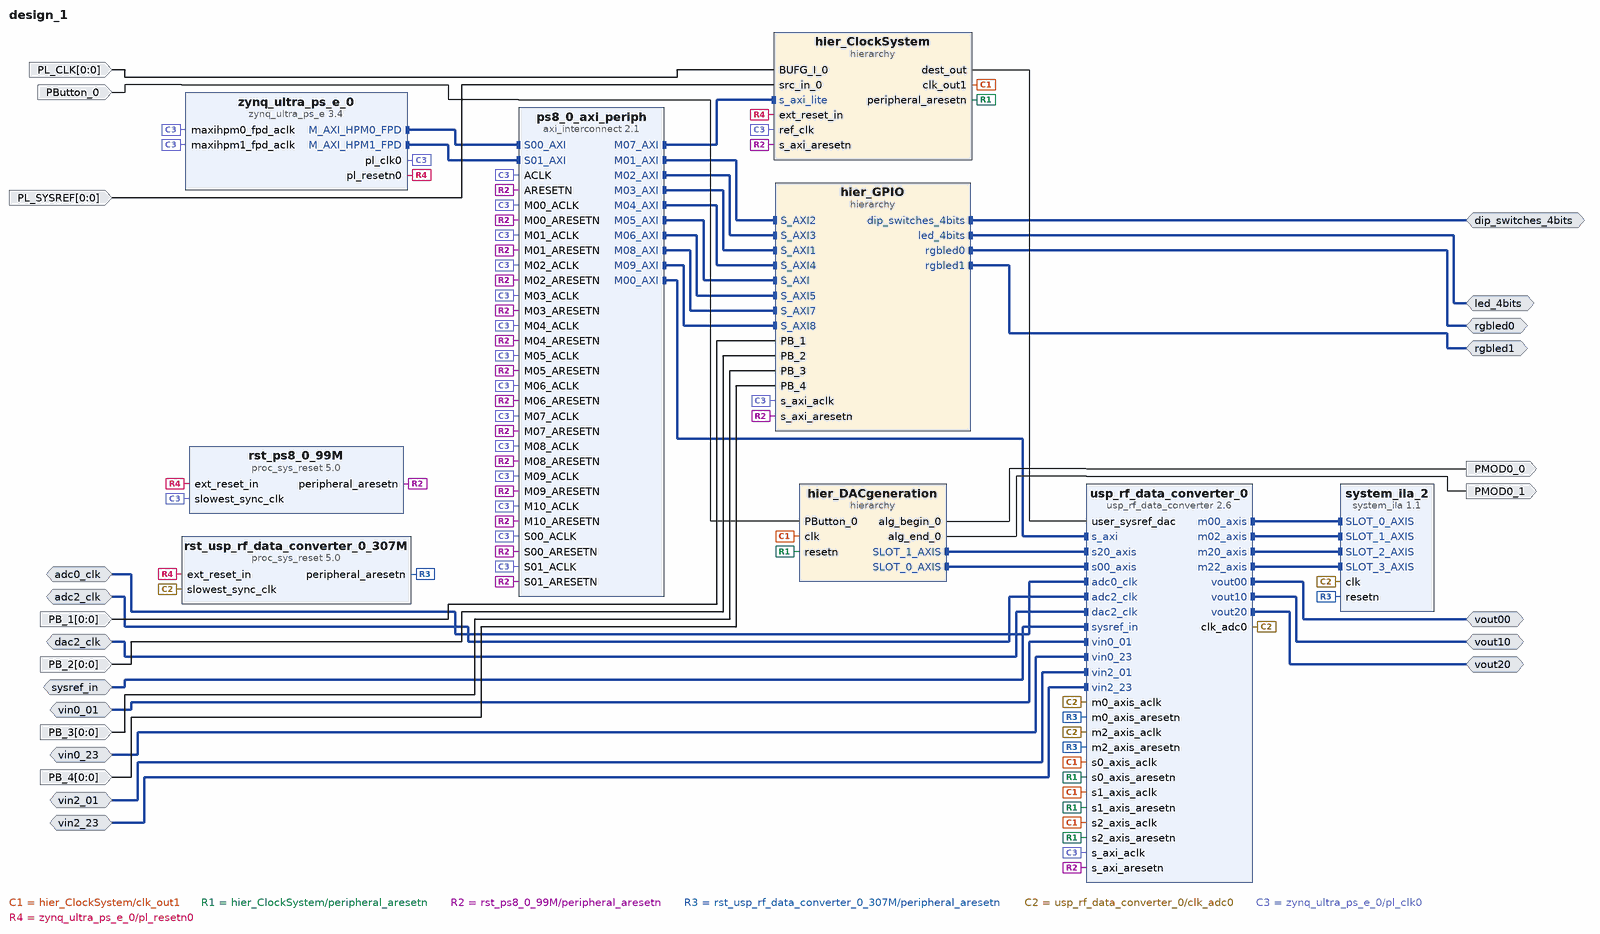
[diagram p0: block diagram of the top level]
# Vivado block design design_1, xczu48dr-ffvg1517-2-e, Vivado 2022.1
create_bd_design design_1

create_bd_intf_port -mode Slave -vlnv xilinx.com:display_usp_rf_data_converter:diff_pins_rtl:1.0 sysref_in
create_bd_intf_port -mode Slave -vlnv xilinx.com:interface:diff_clock_rtl:1.0 adc0_clk
set_property -dict {CONFIG.FREQ_HZ 2000000000.0} [get_bd_intf_ports adc0_clk]
create_bd_intf_port -mode Slave -vlnv xilinx.com:interface:diff_analog_io_rtl:1.0 vin0_01
create_bd_intf_port -mode Master -vlnv xilinx.com:interface:diff_analog_io_rtl:1.0 vout00
create_bd_intf_port -mode Master -vlnv xilinx.com:interface:gpio_rtl:1.0 dip_switches_4bits
create_bd_intf_port -mode Master -vlnv xilinx.com:interface:gpio_rtl:1.0 led_4bits
create_bd_intf_port -mode Master -vlnv xilinx.com:interface:gpio_rtl:1.0 rgbled0
create_bd_intf_port -mode Master -vlnv xilinx.com:interface:gpio_rtl:1.0 rgbled1
create_bd_intf_port -mode Slave -vlnv xilinx.com:interface:diff_analog_io_rtl:1.0 vin0_23
create_bd_intf_port -mode Slave -vlnv xilinx.com:interface:diff_clock_rtl:1.0 adc2_clk
set_property -dict {CONFIG.FREQ_HZ 491520000.0} [get_bd_intf_ports adc2_clk]
create_bd_intf_port -mode Slave -vlnv xilinx.com:interface:diff_analog_io_rtl:1.0 vin2_01
create_bd_intf_port -mode Slave -vlnv xilinx.com:interface:diff_analog_io_rtl:1.0 vin2_23
create_bd_intf_port -mode Slave -vlnv xilinx.com:interface:diff_clock_rtl:1.0 dac2_clk
set_property -dict {CONFIG.FREQ_HZ 491520000.0} [get_bd_intf_ports dac2_clk]
create_bd_intf_port -mode Master -vlnv xilinx.com:interface:diff_analog_io_rtl:1.0 vout20
create_bd_intf_port -mode Master -vlnv xilinx.com:interface:diff_analog_io_rtl:1.0 vout10
create_bd_port -dir I PButton_0
create_bd_port -dir I -from 0 -to 0 PB_1
create_bd_port -dir I -from 0 -to 0 PB_2
create_bd_port -dir I -from 0 -to 0 PB_3
create_bd_port -dir I -from 0 -to 0 PB_4
create_bd_port -dir I -from 0 -to 0 -type clk PL_CLK
set_property -dict {CONFIG.FREQ_HZ 500000000} [get_bd_ports PL_CLK]
create_bd_port -dir I -from 0 -to 0 PL_SYSREF
create_bd_port -dir O PMOD0_0
create_bd_port -dir O PMOD0_1

create_bd_cell -type ip -vlnv xilinx.com:ip:zynq_ultra_ps_e:3.4 zynq_ultra_ps_e_0
set_property -dict [list \
  CONFIG.PSU_BANK_0_IO_STANDARD LVCMOS33 \
  CONFIG.PSU_BANK_1_IO_STANDARD LVCMOS18 \
  CONFIG.PSU_BANK_2_IO_STANDARD LVCMOS18 \
  CONFIG.PSU_BANK_3_IO_STANDARD LVCMOS18 \
  CONFIG.PSU_USB3__DUAL_CLOCK_ENABLE 1 \
  CONFIG.PSU__CAN1__PERIPHERAL__ENABLE 0 \
  CONFIG.PSU__CRF_APB__ACPU_CTRL__FREQMHZ 1200 \
  CONFIG.PSU__CRF_APB__ACPU_CTRL__SRCSEL APLL \
  CONFIG.PSU__CRF_APB__APLL_CTRL__SRCSEL PSS_REF_CLK \
  CONFIG.PSU__CRF_APB__DBG_FPD_CTRL__FREQMHZ 250 \
  CONFIG.PSU__CRF_APB__DBG_FPD_CTRL__SRCSEL IOPLL \
  CONFIG.PSU__CRF_APB__DBG_TRACE_CTRL__FREQMHZ 250 \
  CONFIG.PSU__CRF_APB__DBG_TSTMP_CTRL__FREQMHZ 250 \
  CONFIG.PSU__CRF_APB__DBG_TSTMP_CTRL__SRCSEL IOPLL \
  CONFIG.PSU__CRF_APB__DDR_CTRL__FREQMHZ 1200 \
  CONFIG.PSU__CRF_APB__DDR_CTRL__SRCSEL DPLL \
  CONFIG.PSU__CRF_APB__DPDMA_REF_CTRL__FREQMHZ 600 \
  CONFIG.PSU__CRF_APB__DPDMA_REF_CTRL__SRCSEL DPLL \
  CONFIG.PSU__CRF_APB__DPLL_CTRL__SRCSEL PSS_REF_CLK \
  CONFIG.PSU__CRF_APB__DP_AUDIO_REF_CTRL__SRCSEL RPLL \
  CONFIG.PSU__CRF_APB__DP_STC_REF_CTRL__SRCSEL RPLL \
  CONFIG.PSU__CRF_APB__GDMA_REF_CTRL__FREQMHZ 600 \
  CONFIG.PSU__CRF_APB__GDMA_REF_CTRL__SRCSEL DPLL \
  CONFIG.PSU__CRF_APB__GPU_REF_CTRL__FREQMHZ 600 \
  CONFIG.PSU__CRF_APB__TOPSW_LSBUS_CTRL__FREQMHZ 100 \
  CONFIG.PSU__CRF_APB__TOPSW_LSBUS_CTRL__SRCSEL IOPLL \
  CONFIG.PSU__CRF_APB__TOPSW_MAIN_CTRL__FREQMHZ 533.33 \
  CONFIG.PSU__CRF_APB__TOPSW_MAIN_CTRL__SRCSEL DPLL \
  CONFIG.PSU__CRF_APB__VPLL_CTRL__SRCSEL PSS_REF_CLK \
  CONFIG.PSU__CRL_APB__ADMA_REF_CTRL__FREQMHZ 533.333 \
  CONFIG.PSU__CRL_APB__ADMA_REF_CTRL__SRCSEL RPLL \
  CONFIG.PSU__CRL_APB__CAN1_REF_CTRL__SRCSEL IOPLL \
  CONFIG.PSU__CRL_APB__CPU_R5_CTRL__FREQMHZ 500 \
  CONFIG.PSU__CRL_APB__CPU_R5_CTRL__SRCSEL IOPLL \
  CONFIG.PSU__CRL_APB__DBG_LPD_CTRL__FREQMHZ 250 \
  CONFIG.PSU__CRL_APB__DBG_LPD_CTRL__SRCSEL IOPLL \
  CONFIG.PSU__CRL_APB__GEM3_REF_CTRL__FREQMHZ 125 \
  CONFIG.PSU__CRL_APB__GEM3_REF_CTRL__SRCSEL IOPLL \
  CONFIG.PSU__CRL_APB__I2C1_REF_CTRL__FREQMHZ 100 \
  CONFIG.PSU__CRL_APB__I2C1_REF_CTRL__SRCSEL IOPLL \
  CONFIG.PSU__CRL_APB__IOPLL_CTRL__SRCSEL PSS_REF_CLK \
  CONFIG.PSU__CRL_APB__IOU_SWITCH_CTRL__FREQMHZ 267 \
  CONFIG.PSU__CRL_APB__IOU_SWITCH_CTRL__SRCSEL RPLL \
  CONFIG.PSU__CRL_APB__LPD_LSBUS_CTRL__FREQMHZ 100 \
  CONFIG.PSU__CRL_APB__LPD_LSBUS_CTRL__SRCSEL IOPLL \
  CONFIG.PSU__CRL_APB__LPD_SWITCH_CTRL__FREQMHZ 533.333 \
  CONFIG.PSU__CRL_APB__LPD_SWITCH_CTRL__SRCSEL RPLL \
  CONFIG.PSU__CRL_APB__PCAP_CTRL__FREQMHZ 200 \
  CONFIG.PSU__CRL_APB__PCAP_CTRL__SRCSEL IOPLL \
  CONFIG.PSU__CRL_APB__PL0_REF_CTRL__FREQMHZ 100 \
  CONFIG.PSU__CRL_APB__PL0_REF_CTRL__SRCSEL IOPLL \
  CONFIG.PSU__CRL_APB__QSPI_REF_CTRL__FREQMHZ 125 \
  CONFIG.PSU__CRL_APB__RPLL_CTRL__SRCSEL PSS_REF_CLK \
  CONFIG.PSU__CRL_APB__SDIO0_REF_CTRL__SRCSEL IOPLL \
  CONFIG.PSU__CRL_APB__SDIO1_REF_CTRL__FREQMHZ 200 \
  CONFIG.PSU__CRL_APB__SDIO1_REF_CTRL__SRCSEL IOPLL \
  CONFIG.PSU__CRL_APB__SPI0_REF_CTRL__SRCSEL IOPLL \
  CONFIG.PSU__CRL_APB__SPI1_REF_CTRL__SRCSEL IOPLL \
  CONFIG.PSU__CRL_APB__TIMESTAMP_REF_CTRL__FREQMHZ 100 \
  CONFIG.PSU__CRL_APB__TIMESTAMP_REF_CTRL__SRCSEL PSS_REF_CLK \
  CONFIG.PSU__CRL_APB__UART0_REF_CTRL__FREQMHZ 100 \
  CONFIG.PSU__CRL_APB__UART0_REF_CTRL__SRCSEL IOPLL \
  CONFIG.PSU__CRL_APB__USB0_BUS_REF_CTRL__FREQMHZ 250 \
  CONFIG.PSU__CRL_APB__USB0_BUS_REF_CTRL__SRCSEL IOPLL \
  CONFIG.PSU__CRL_APB__USB3_DUAL_REF_CTRL__FREQMHZ 20 \
  CONFIG.PSU__CRL_APB__USB3_DUAL_REF_CTRL__SRCSEL IOPLL \
  CONFIG.PSU__CRL_APB__USB3__ENABLE 1 \
  CONFIG.PSU__DDRC__BUS_WIDTH {64 Bit} \
  CONFIG.PSU__DDRC__COMPONENTS Components \
  CONFIG.PSU__DDRC__DEVICE_CAPACITY {8192 MBits} \
  CONFIG.PSU__DDRC__DRAM_WIDTH {16 Bits} \
  CONFIG.PSU__DDRC__ECC Disabled \
  CONFIG.PSU__DDRC__MEMORY_TYPE {DDR 4} \
  CONFIG.PSU__DDRC__SPEED_BIN DDR4_2400R \
  CONFIG.PSU__DDR_HIGH_ADDRESS_GUI_ENABLE 1 \
  CONFIG.PSU__DDR__INTERFACE__FREQMHZ 600.000 \
  CONFIG.PSU__DISPLAYPORT__LANE0__ENABLE 1 \
  CONFIG.PSU__DISPLAYPORT__LANE0__IO {GT Lane1} \
  CONFIG.PSU__DISPLAYPORT__LANE1__ENABLE 1 \
  CONFIG.PSU__DISPLAYPORT__LANE1__IO {GT Lane0} \
  CONFIG.PSU__DISPLAYPORT__PERIPHERAL__ENABLE 1 \
  CONFIG.PSU__DLL__ISUSED 1 \
  CONFIG.PSU__DPAUX__PERIPHERAL__ENABLE 1 \
  CONFIG.PSU__DPAUX__PERIPHERAL__IO {MIO 27 .. 30} \
  CONFIG.PSU__DP__LANE_SEL {Dual Lower} \
  CONFIG.PSU__DP__REF_CLK_FREQ 27 \
  CONFIG.PSU__DP__REF_CLK_SEL {Ref Clk0} \
  CONFIG.PSU__ENET1__GRP_MDIO__ENABLE 1 \
  CONFIG.PSU__ENET1__GRP_MDIO__IO {MIO 50 .. 51} \
  CONFIG.PSU__ENET1__PERIPHERAL__ENABLE 1 \
  CONFIG.PSU__ENET1__PERIPHERAL__IO {MIO 38 .. 49} \
  CONFIG.PSU__FPGA_PL0_ENABLE 1 \
  CONFIG.PSU__GEM__TSU__ENABLE 0 \
  CONFIG.PSU__GPIO0_MIO__IO {MIO 0 .. 25} \
  CONFIG.PSU__GPIO0_MIO__PERIPHERAL__ENABLE 1 \
  CONFIG.PSU__GPIO1_MIO__IO {MIO 26 .. 51} \
  CONFIG.PSU__GPIO1_MIO__PERIPHERAL__ENABLE 1 \
  CONFIG.PSU__GPIO2_MIO__IO {MIO 52 .. 77} \
  CONFIG.PSU__GPIO2_MIO__PERIPHERAL__ENABLE 1 \
  CONFIG.PSU__GPIO_EMIO_WIDTH 41 \
  CONFIG.PSU__GPIO_EMIO__PERIPHERAL__ENABLE 1 \
  CONFIG.PSU__GPIO_EMIO__PERIPHERAL__IO 41 \
  CONFIG.PSU__GT__LINK_SPEED HBR \
  CONFIG.PSU__GT__PRE_EMPH_LVL_4 0 \
  CONFIG.PSU__GT__VLT_SWNG_LVL_4 0 \
  CONFIG.PSU__I2C0__PERIPHERAL__ENABLE 1 \
  CONFIG.PSU__I2C0__PERIPHERAL__IO {MIO 18 .. 19} \
  CONFIG.PSU__I2C1__PERIPHERAL__ENABLE 1 \
  CONFIG.PSU__I2C1__PERIPHERAL__IO {MIO 36 .. 37} \
  CONFIG.PSU__MAXIGP0__DATA_WIDTH 128 \
  CONFIG.PSU__OVERRIDE__BASIC_CLOCK 0 \
  CONFIG.PSU__PMU__PERIPHERAL__ENABLE 0 \
  CONFIG.PSU__PRESET_APPLIED 1 \
  CONFIG.PSU__PSS_REF_CLK__FREQMHZ 33.33333 \
  CONFIG.PSU__QSPI__PERIPHERAL__ENABLE 0 \
  CONFIG.PSU__SD0__CLK_50_SDR_ITAP_DLY 0x15 \
  CONFIG.PSU__SD0__CLK_50_SDR_OTAP_DLY 0x5 \
  CONFIG.PSU__SD0__DATA_TRANSFER_MODE 4Bit \
  CONFIG.PSU__SD0__GRP_CD__ENABLE 1 \
  CONFIG.PSU__SD0__GRP_CD__IO {MIO 24} \
  CONFIG.PSU__SD0__GRP_WP__ENABLE 1 \
  CONFIG.PSU__SD0__GRP_WP__IO {MIO 25} \
  CONFIG.PSU__SD0__PERIPHERAL__ENABLE 1 \
  CONFIG.PSU__SD0__PERIPHERAL__IO {MIO 13 .. 16 21 22} \
  CONFIG.PSU__SD0__SLOT_TYPE {SD 2.0} \
  CONFIG.PSU__SPI0__GRP_SS0__IO {MIO 3} \
  CONFIG.PSU__SPI0__GRP_SS1__ENABLE 1 \
  CONFIG.PSU__SPI0__GRP_SS1__IO {MIO 2} \
  CONFIG.PSU__SPI0__GRP_SS2__ENABLE 1 \
  CONFIG.PSU__SPI0__GRP_SS2__IO {MIO 1} \
  CONFIG.PSU__SPI0__PERIPHERAL__ENABLE 1 \
  CONFIG.PSU__SPI0__PERIPHERAL__IO {MIO 0 .. 5} \
  CONFIG.PSU__SPI1__GRP_SS0__IO {MIO 9} \
  CONFIG.PSU__SPI1__PERIPHERAL__ENABLE 1 \
  CONFIG.PSU__SPI1__PERIPHERAL__IO {MIO 6 .. 11} \
  CONFIG.PSU__TSU__BUFG_PORT_PAIR 0 \
  CONFIG.PSU__UART0__PERIPHERAL__ENABLE 0 \
  CONFIG.PSU__UART1__BAUD_RATE 115200 \
  CONFIG.PSU__UART1__MODEM__ENABLE 0 \
  CONFIG.PSU__UART1__PERIPHERAL__ENABLE 1 \
  CONFIG.PSU__UART1__PERIPHERAL__IO {MIO 32 .. 33} \
  CONFIG.PSU__USB0_COHERENCY 0 \
  CONFIG.PSU__USB0__PERIPHERAL__ENABLE 1 \
  CONFIG.PSU__USB0__PERIPHERAL__IO {MIO 52 .. 63} \
  CONFIG.PSU__USB0__REF_CLK_FREQ 100 \
  CONFIG.PSU__USB0__REF_CLK_SEL {Ref Clk1} \
  CONFIG.PSU__USB1__PERIPHERAL__ENABLE 1 \
  CONFIG.PSU__USB1__PERIPHERAL__IO {MIO 64 .. 75} \
  CONFIG.PSU__USB1__REF_CLK_FREQ 100 \
  CONFIG.PSU__USB1__REF_CLK_SEL {Ref Clk1} \
  CONFIG.PSU__USB2_0__EMIO__ENABLE 0 \
  CONFIG.PSU__USB3_0__EMIO__ENABLE 0 \
  CONFIG.PSU__USB3_0__PERIPHERAL__ENABLE 1 \
  CONFIG.PSU__USB3_0__PERIPHERAL__IO {GT Lane2} \
  CONFIG.PSU__USB3_1__PERIPHERAL__ENABLE 1 \
  CONFIG.PSU__USB3_1__PERIPHERAL__IO {GT Lane3} \
  CONFIG.PSU__USB__RESET__MODE {Boot Pin} \
  CONFIG.PSU__USB__RESET__POLARITY {Active Low} \
  CONFIG.PSU__USE__IRQ0 1 \
  CONFIG.PSU__USE__IRQ1 1 \
  CONFIG.PSU__USE__M_AXI_GP0 1 \
  CONFIG.PSU__USE__M_AXI_GP1 1 \
  CONFIG.PSU__USE__M_AXI_GP2 0 \
] [get_bd_cells zynq_ultra_ps_e_0]
# 106 more settings of zynq_ultra_ps_e_0 are not shown: defaults, MIO pin electricals, DDR timing, and values the tool derives
create_bd_cell -type ip -vlnv xilinx.com:ip:usp_rf_data_converter:2.6 usp_rf_data_converter_0
set_property -dict [list \
  CONFIG.ADC0_Link_Coupling 0 \
  CONFIG.ADC0_Outclk_Freq 281.250 \
  CONFIG.ADC0_PLL_Enable true \
  CONFIG.ADC0_Refclk_Freq 500.000 \
  CONFIG.ADC0_Sampling_Rate 4.5 \
  CONFIG.ADC2_Outclk_Freq 281.250 \
  CONFIG.ADC2_PLL_Enable true \
  CONFIG.ADC2_Refclk_Freq 500.000 \
  CONFIG.ADC2_Sampling_Rate 4.5 \
  CONFIG.ADC_Coarse_Mixer_Freq02 3 \
  CONFIG.ADC_Coarse_Mixer_Freq20 3 \
  CONFIG.ADC_Coarse_Mixer_Freq22 3 \
  CONFIG.ADC_Data_Width00 1 \
  CONFIG.ADC_Data_Width02 1 \
  CONFIG.ADC_Data_Width20 1 \
  CONFIG.ADC_Data_Width22 1 \
  CONFIG.ADC_Decimation_Mode00 16 \
  CONFIG.ADC_Decimation_Mode02 16 \
  CONFIG.ADC_Decimation_Mode20 16 \
  CONFIG.ADC_Decimation_Mode22 16 \
  CONFIG.ADC_Mixer_Type02 1 \
  CONFIG.ADC_Mixer_Type20 1 \
  CONFIG.ADC_Mixer_Type22 1 \
  CONFIG.ADC_OBS02 false \
  CONFIG.ADC_OBS22 false \
  CONFIG.ADC_Slice02_Enable true \
  CONFIG.ADC_Slice20_Enable true \
  CONFIG.ADC_Slice22_Enable true \
  CONFIG.DAC0_Clock_Source 6 \
  CONFIG.DAC0_Link_Coupling 0 \
  CONFIG.DAC0_Multi_Tile_Sync true \
  CONFIG.DAC0_Outclk_Freq 406.250 \
  CONFIG.DAC0_PLL_Enable false \
  CONFIG.DAC0_Refclk_Freq 6500.000 \
  CONFIG.DAC0_Sampling_Rate 6.5 \
  CONFIG.DAC1_Multi_Tile_Sync true \
  CONFIG.DAC1_Outclk_Freq 406.250 \
  CONFIG.DAC1_PLL_Enable false \
  CONFIG.DAC1_Refclk_Freq 6500.000 \
  CONFIG.DAC1_Sampling_Rate 6.5 \
  CONFIG.DAC2_Clock_Dist 2 \
  CONFIG.DAC2_Multi_Tile_Sync true \
  CONFIG.DAC2_Outclk_Freq 406.250 \
  CONFIG.DAC2_PLL_Enable true \
  CONFIG.DAC2_Refclk_Freq 500.000 \
  CONFIG.DAC2_Sampling_Rate 6.5 \
  CONFIG.DAC_Coarse_Mixer_Freq00 3 \
  CONFIG.DAC_Coarse_Mixer_Freq10 3 \
  CONFIG.DAC_Coarse_Mixer_Freq20 3 \
  CONFIG.DAC_Data_Width00 16 \
  CONFIG.DAC_Data_Width10 16 \
  CONFIG.DAC_Data_Width20 16 \
  CONFIG.DAC_Interpolation_Mode00 1 \
  CONFIG.DAC_Interpolation_Mode10 1 \
  CONFIG.DAC_Interpolation_Mode20 1 \
  CONFIG.DAC_Mixer_Type00 1 \
  CONFIG.DAC_Mixer_Type10 1 \
  CONFIG.DAC_Mixer_Type20 1 \
  CONFIG.DAC_Slice00_Enable true \
  CONFIG.DAC_Slice10_Enable true \
  CONFIG.DAC_Slice20_Enable true \
] [get_bd_cells usp_rf_data_converter_0]
create_bd_cell -type ip -vlnv xilinx.com:ip:axi_interconnect:2.1 ps8_0_axi_periph
set_property -dict {CONFIG.NUM_MI 11 CONFIG.NUM_SI 2} [get_bd_cells ps8_0_axi_periph]
create_bd_cell -type ip -vlnv xilinx.com:ip:proc_sys_reset:5.0 rst_ps8_0_99M
create_bd_cell -type ip -vlnv xilinx.com:ip:proc_sys_reset:5.0 rst_usp_rf_data_converter_0_307M
set_property -dict [list \
  CONFIG.RESET_BOARD_INTERFACE Custom \
  CONFIG.USE_BOARD_FLOW true \
] [get_bd_cells rst_usp_rf_data_converter_0_307M]
create_bd_cell -type hier hier_GPIO
create_bd_cell -type ip -vlnv xilinx.com:ip:system_ila:1.1 system_ila_2
set_property -dict [list \
  CONFIG.C_NUM_MONITOR_SLOTS 4 \
  CONFIG.C_SLOT 3 \
  CONFIG.C_SLOT_0_INTF_TYPE xilinx.com:interface:axis_rtl:1.0 \
  CONFIG.C_SLOT_1_INTF_TYPE xilinx.com:interface:axis_rtl:1.0 \
  CONFIG.C_SLOT_2_INTF_TYPE xilinx.com:interface:axis_rtl:1.0 \
  CONFIG.C_SLOT_3_INTF_TYPE xilinx.com:interface:axis_rtl:1.0 \
] [get_bd_cells system_ila_2]
create_bd_cell -type hier hier_ClockSystem
create_bd_cell -type hier hier_DACgeneration

# ---- hierarchy /hier_GPIO ----
current_bd_instance /hier_GPIO
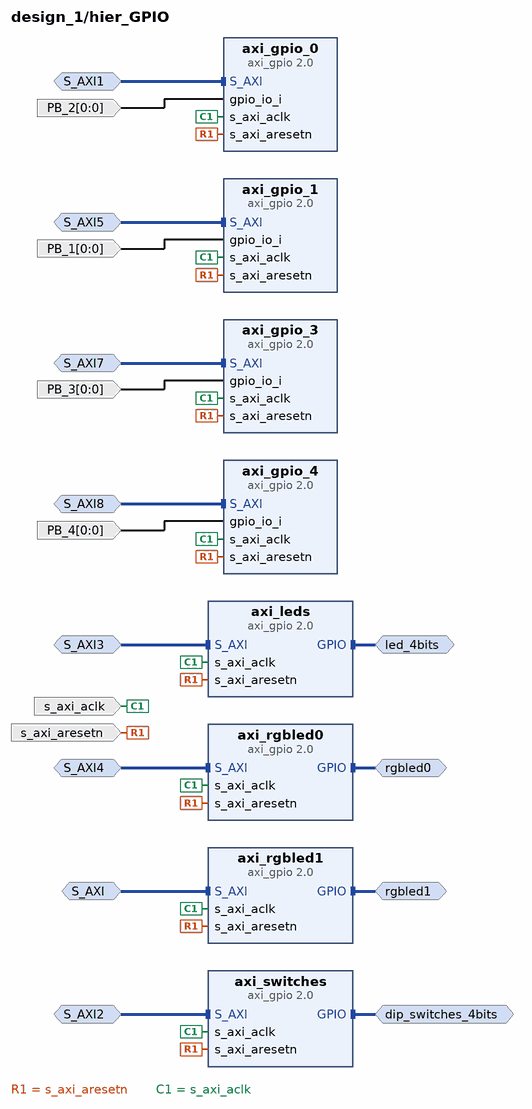
[diagram p1: block diagram inside /hier_GPIO]
create_bd_intf_pin -mode Slave -vlnv xilinx.com:interface:aximm_rtl:1.0 S_AXI
create_bd_intf_pin -mode Master -vlnv xilinx.com:interface:gpio_rtl:1.0 rgbled1
create_bd_intf_pin -mode Slave -vlnv xilinx.com:interface:aximm_rtl:1.0 S_AXI1
create_bd_intf_pin -mode Slave -vlnv xilinx.com:interface:aximm_rtl:1.0 S_AXI2
create_bd_intf_pin -mode Master -vlnv xilinx.com:interface:gpio_rtl:1.0 dip_switches_4bits
create_bd_intf_pin -mode Slave -vlnv xilinx.com:interface:aximm_rtl:1.0 S_AXI3
create_bd_intf_pin -mode Master -vlnv xilinx.com:interface:gpio_rtl:1.0 led_4bits
create_bd_intf_pin -mode Slave -vlnv xilinx.com:interface:aximm_rtl:1.0 S_AXI4
create_bd_intf_pin -mode Master -vlnv xilinx.com:interface:gpio_rtl:1.0 rgbled0
create_bd_intf_pin -mode Slave -vlnv xilinx.com:interface:aximm_rtl:1.0 S_AXI5
create_bd_intf_pin -mode Slave -vlnv xilinx.com:interface:aximm_rtl:1.0 S_AXI7
create_bd_intf_pin -mode Slave -vlnv xilinx.com:interface:aximm_rtl:1.0 S_AXI8
create_bd_pin -dir I -type clk s_axi_aclk
create_bd_pin -dir I -type rst s_axi_aresetn
create_bd_pin -dir I -from 0 -to 0 PB_1
create_bd_pin -dir I -from 0 -to 0 PB_2
create_bd_pin -dir I -from 0 -to 0 PB_3
create_bd_pin -dir I -from 0 -to 0 PB_4

create_bd_cell -type ip -vlnv xilinx.com:ip:axi_gpio:2.0 axi_rgbled1
set_property -dict {CONFIG.GPIO_BOARD_INTERFACE rgbled1 CONFIG.USE_BOARD_FLOW true} [get_bd_cells axi_rgbled1]
create_bd_cell -type ip -vlnv xilinx.com:ip:axi_gpio:2.0 axi_gpio_0
set_property -dict [list \
  CONFIG.C_ALL_INPUTS 1 \
  CONFIG.C_GPIO_WIDTH 1 \
  CONFIG.GPIO_BOARD_INTERFACE Custom \
  CONFIG.USE_BOARD_FLOW true \
] [get_bd_cells axi_gpio_0]
create_bd_cell -type ip -vlnv xilinx.com:ip:axi_gpio:2.0 axi_switches
set_property -dict {CONFIG.GPIO_BOARD_INTERFACE dip_switches_4bits CONFIG.USE_BOARD_FLOW true} [get_bd_cells axi_switches]
create_bd_cell -type ip -vlnv xilinx.com:ip:axi_gpio:2.0 axi_leds
set_property -dict {CONFIG.GPIO_BOARD_INTERFACE led_4bits CONFIG.USE_BOARD_FLOW true} [get_bd_cells axi_leds]
create_bd_cell -type ip -vlnv xilinx.com:ip:axi_gpio:2.0 axi_rgbled0
set_property -dict {CONFIG.GPIO_BOARD_INTERFACE rgbled0 CONFIG.USE_BOARD_FLOW true} [get_bd_cells axi_rgbled0]
create_bd_cell -type ip -vlnv xilinx.com:ip:axi_gpio:2.0 axi_gpio_1
set_property -dict [list \
  CONFIG.C_ALL_INPUTS 1 \
  CONFIG.C_GPIO_WIDTH 1 \
  CONFIG.GPIO_BOARD_INTERFACE Custom \
  CONFIG.USE_BOARD_FLOW true \
] [get_bd_cells axi_gpio_1]
create_bd_cell -type ip -vlnv xilinx.com:ip:axi_gpio:2.0 axi_gpio_3
set_property -dict [list \
  CONFIG.C_ALL_INPUTS 1 \
  CONFIG.C_GPIO_WIDTH 1 \
  CONFIG.GPIO_BOARD_INTERFACE Custom \
  CONFIG.USE_BOARD_FLOW true \
] [get_bd_cells axi_gpio_3]
create_bd_cell -type ip -vlnv xilinx.com:ip:axi_gpio:2.0 axi_gpio_4
set_property -dict [list \
  CONFIG.C_ALL_INPUTS 1 \
  CONFIG.C_GPIO_WIDTH 1 \
  CONFIG.GPIO_BOARD_INTERFACE Custom \
  CONFIG.USE_BOARD_FLOW true \
] [get_bd_cells axi_gpio_4]

# ---- hierarchy /hier_ClockSystem ----
current_bd_instance /hier_ClockSystem
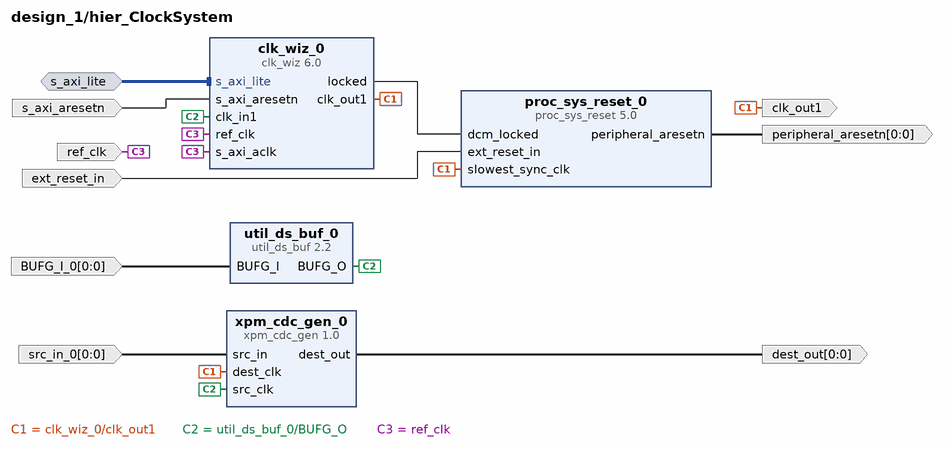
[diagram p2: block diagram inside /hier_ClockSystem]
create_bd_intf_pin -mode Slave -vlnv xilinx.com:interface:aximm_rtl:1.0 s_axi_lite
create_bd_pin -dir I -from 0 -to 0 -type clk BUFG_I_0
create_bd_pin -dir O -type clk clk_out1
create_bd_pin -dir I -type rst ext_reset_in
create_bd_pin -dir O -from 0 -to 0 -type rst peripheral_aresetn
create_bd_pin -dir I -type clk ref_clk
create_bd_pin -dir I -type rst s_axi_aresetn
create_bd_pin -dir O -from 0 -to 0 dest_out
create_bd_pin -dir I -from 0 -to 0 src_in_0

create_bd_cell -type ip -vlnv xilinx.com:ip:util_ds_buf:2.2 util_ds_buf_0
set_property -dict {CONFIG.C_BUF_TYPE BUFG} [get_bd_cells util_ds_buf_0]
create_bd_cell -type ip -vlnv xilinx.com:ip:proc_sys_reset:5.0 proc_sys_reset_0
set_property -dict {CONFIG.RESET_BOARD_INTERFACE Custom CONFIG.USE_BOARD_FLOW true} [get_bd_cells proc_sys_reset_0]
create_bd_cell -type ip -vlnv xilinx.com:ip:clk_wiz:6.0 clk_wiz_0
set_property -dict [list \
  CONFIG.CLKIN1_JITTER_PS 0.1 \
  CONFIG.CLKIN1_UI_JITTER 0.1 \
  CONFIG.CLKIN2_JITTER_PS 100.000 \
  CONFIG.CLKIN2_UI_JITTER 100.000 \
  CONFIG.CLKOUT1_DRIVES Buffer \
  CONFIG.CLKOUT1_JITTER 76.596 \
  CONFIG.CLKOUT1_MATCHED_ROUTING true \
  CONFIG.CLKOUT1_PHASE_ERROR 76.744 \
  CONFIG.CLKOUT1_REQUESTED_OUT_FREQ 406.25 \
  CONFIG.CLKOUT2_DRIVES Buffer \
  CONFIG.CLKOUT3_DRIVES Buffer \
  CONFIG.CLKOUT4_DRIVES Buffer \
  CONFIG.CLKOUT5_DRIVES Buffer \
  CONFIG.CLKOUT6_DRIVES Buffer \
  CONFIG.CLKOUT7_DRIVES Buffer \
  CONFIG.ENABLE_CLOCK_MONITOR true \
  CONFIG.JITTER_OPTIONS PS \
  CONFIG.JITTER_SEL Min_O_Jitter \
  CONFIG.MMCM_BANDWIDTH HIGH \
  CONFIG.MMCM_CLKFBOUT_MULT_F 11.375 \
  CONFIG.MMCM_CLKIN1_PERIOD 2.000 \
  CONFIG.MMCM_CLKIN2_PERIOD 10.0 \
  CONFIG.MMCM_CLKOUT0_DIVIDE_F 3.500 \
  CONFIG.MMCM_DIVCLK_DIVIDE 4 \
  CONFIG.MMCM_REF_JITTER1 0.000 \
  CONFIG.MMCM_REF_JITTER2 0.010 \
  CONFIG.PRIMITIVE MMCM \
  CONFIG.PRIM_IN_FREQ 500.0 \
  CONFIG.PRIM_SOURCE Global_buffer \
  CONFIG.SECONDARY_SOURCE Single_ended_clock_capable_pin \
  CONFIG.USE_DYN_PHASE_SHIFT false \
  CONFIG.USE_PHASE_ALIGNMENT true \
] [get_bd_cells clk_wiz_0]
create_bd_cell -type ip -vlnv xilinx.com:ip:xpm_cdc_gen:1.0 xpm_cdc_gen_0
set_property -dict [list \
  CONFIG.CDC_TYPE xpm_cdc_single \
  CONFIG.DEST_SYNC_FF 2 \
  CONFIG.INIT_SYNC_FF true \
  CONFIG.WIDTH 1 \
] [get_bd_cells xpm_cdc_gen_0]

# ---- hierarchy /hier_DACgeneration ----
current_bd_instance /hier_DACgeneration
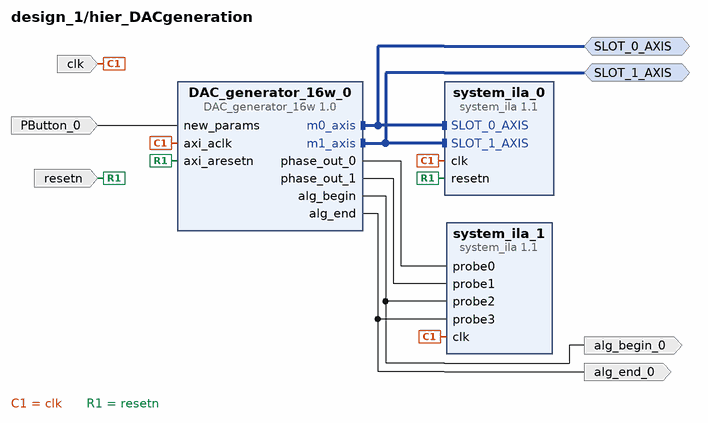
[diagram p3: block diagram inside /hier_DACgeneration]
create_bd_intf_pin -mode Master -vlnv xilinx.com:interface:axis_rtl:1.0 SLOT_0_AXIS
create_bd_intf_pin -mode Master -vlnv xilinx.com:interface:axis_rtl:1.0 SLOT_1_AXIS
create_bd_pin -dir I -type clk clk
create_bd_pin -dir I -type rst resetn
create_bd_pin -dir I PButton_0
create_bd_pin -dir O alg_begin_0
create_bd_pin -dir O alg_end_0

create_bd_cell -type ip -vlnv xilinx.com:ip:system_ila:1.1 system_ila_0
set_property -dict [list \
  CONFIG.C_NUM_MONITOR_SLOTS 2 \
  CONFIG.C_SLOT 1 \
  CONFIG.C_SLOT_0_INTF_TYPE xilinx.com:interface:axis_rtl:1.0 \
  CONFIG.C_SLOT_1_INTF_TYPE xilinx.com:interface:axis_rtl:1.0 \
] [get_bd_cells system_ila_0]
create_bd_cell -type ip -vlnv xilinx.com:ip:system_ila:1.1 system_ila_1
set_property -dict [list \
  CONFIG.ALL_PROBE_SAME_MU true \
  CONFIG.ALL_PROBE_SAME_MU_CNT 1 \
  CONFIG.C_EN_STRG_QUAL 0 \
  CONFIG.C_MON_TYPE NATIVE \
  CONFIG.C_NUM_OF_PROBES 4 \
  CONFIG.C_PROBE0_MU_CNT 1 \
  CONFIG.C_PROBE0_WIDTH 20 \
  CONFIG.C_PROBE1_MU_CNT 1 \
  CONFIG.C_PROBE1_WIDTH 20 \
  CONFIG.C_PROBE_WIDTH_PROPAGATION MANUAL \
  CONFIG.C_TRIGIN_EN false \
  CONFIG.C_TRIGOUT_EN false \
] [get_bd_cells system_ila_1]
create_bd_cell -type ip -vlnv xilinx.com:user:DAC_generator_16w:1.0 DAC_generator_16w_0

# ---- connections ----

current_bd_instance /hier_GPIO
connect_bd_intf_net [get_bd_intf_pins S_AXI5] [get_bd_intf_pins axi_gpio_1/S_AXI]
connect_bd_intf_net [get_bd_intf_pins S_AXI7] [get_bd_intf_pins axi_gpio_3/S_AXI]
connect_bd_intf_net [get_bd_intf_pins S_AXI8] [get_bd_intf_pins axi_gpio_4/S_AXI]
connect_bd_intf_net -intf_net axi_gpio_0_GPIO [get_bd_intf_pins dip_switches_4bits] [get_bd_intf_pins axi_switches/GPIO]
connect_bd_intf_net -intf_net axi_gpio_1_GPIO [get_bd_intf_pins led_4bits] [get_bd_intf_pins axi_leds/GPIO]
connect_bd_intf_net -intf_net axi_gpio_3_GPIO [get_bd_intf_pins rgbled0] [get_bd_intf_pins axi_rgbled0/GPIO]
connect_bd_intf_net -intf_net axi_gpio_4_GPIO [get_bd_intf_pins rgbled1] [get_bd_intf_pins axi_rgbled1/GPIO]
connect_bd_intf_net [get_bd_intf_pins S_AXI2] [get_bd_intf_pins axi_switches/S_AXI]
connect_bd_intf_net [get_bd_intf_pins S_AXI3] [get_bd_intf_pins axi_leds/S_AXI]
connect_bd_intf_net [get_bd_intf_pins S_AXI1] [get_bd_intf_pins axi_gpio_0/S_AXI]
connect_bd_intf_net [get_bd_intf_pins S_AXI4] [get_bd_intf_pins axi_rgbled0/S_AXI]
connect_bd_intf_net [get_bd_intf_pins S_AXI] [get_bd_intf_pins axi_rgbled1/S_AXI]
connect_bd_net -net gpio_io_i_0_1 [get_bd_pins PB_1] [get_bd_pins axi_gpio_1/gpio_io_i]
connect_bd_net -net gpio_io_i_1_1 [get_bd_pins PB_2] [get_bd_pins axi_gpio_0/gpio_io_i]
connect_bd_net -net gpio_io_i_2_1 [get_bd_pins PB_3] [get_bd_pins axi_gpio_3/gpio_io_i]
connect_bd_net -net gpio_io_i_3_1 [get_bd_pins PB_4] [get_bd_pins axi_gpio_4/gpio_io_i]
connect_bd_net -net rst_ps8_0_99M_peripheral_aresetn [get_bd_pins s_axi_aresetn] \
  [get_bd_pins axi_switches/s_axi_aresetn] [get_bd_pins axi_leds/s_axi_aresetn] [get_bd_pins axi_rgbled0/s_axi_aresetn] \
  [get_bd_pins axi_gpio_0/s_axi_aresetn] [get_bd_pins axi_rgbled1/s_axi_aresetn] [get_bd_pins axi_gpio_1/s_axi_aresetn] \
  [get_bd_pins axi_gpio_3/s_axi_aresetn] [get_bd_pins axi_gpio_4/s_axi_aresetn]
connect_bd_net -net zynq_ultra_ps_e_0_pl_clk0 [get_bd_pins s_axi_aclk] \
  [get_bd_pins axi_switches/s_axi_aclk] [get_bd_pins axi_leds/s_axi_aclk] [get_bd_pins axi_rgbled0/s_axi_aclk] \
  [get_bd_pins axi_gpio_0/s_axi_aclk] [get_bd_pins axi_rgbled1/s_axi_aclk] [get_bd_pins axi_gpio_1/s_axi_aclk] \
  [get_bd_pins axi_gpio_3/s_axi_aclk] [get_bd_pins axi_gpio_4/s_axi_aclk]

current_bd_instance /hier_ClockSystem
connect_bd_intf_net [get_bd_intf_pins s_axi_lite] [get_bd_intf_pins clk_wiz_0/s_axi_lite]
connect_bd_net -net BUFG_I_0_1 [get_bd_pins BUFG_I_0] [get_bd_pins util_ds_buf_0/BUFG_I]
connect_bd_net [get_bd_pins clk_wiz_0/clk_out1] \
  [get_bd_pins clk_out1] [get_bd_pins xpm_cdc_gen_0/dest_clk] [get_bd_pins proc_sys_reset_0/slowest_sync_clk]
connect_bd_net [get_bd_pins clk_wiz_0/locked] [get_bd_pins proc_sys_reset_0/dcm_locked]
connect_bd_net [get_bd_pins proc_sys_reset_0/peripheral_aresetn] [get_bd_pins peripheral_aresetn]
connect_bd_net -net rst_ps8_0_99M_peripheral_aresetn [get_bd_pins s_axi_aresetn] [get_bd_pins clk_wiz_0/s_axi_aresetn]
connect_bd_net -net src_in_0_1 [get_bd_pins src_in_0] [get_bd_pins xpm_cdc_gen_0/src_in]
connect_bd_net [get_bd_pins util_ds_buf_0/BUFG_O] [get_bd_pins clk_wiz_0/clk_in1] [get_bd_pins xpm_cdc_gen_0/src_clk]
connect_bd_net [get_bd_pins xpm_cdc_gen_0/dest_out] [get_bd_pins dest_out]
connect_bd_net -net zynq_ultra_ps_e_0_pl_clk0 [get_bd_pins ref_clk] [get_bd_pins clk_wiz_0/ref_clk] [get_bd_pins clk_wiz_0/s_axi_aclk]
connect_bd_net -net zynq_ultra_ps_e_0_pl_resetn0 [get_bd_pins ext_reset_in] [get_bd_pins proc_sys_reset_0/ext_reset_in]

current_bd_instance /hier_DACgeneration
connect_bd_intf_net -intf_net DAC_generator_2chann_0_m1_axis [get_bd_intf_pins SLOT_1_AXIS] [get_bd_intf_pins DAC_generator_16w_0/m1_axis]
connect_bd_intf_net [get_bd_intf_pins SLOT_1_AXIS] [get_bd_intf_pins system_ila_0/SLOT_1_AXIS]
connect_bd_intf_net -intf_net axis_constant_0_m_axis [get_bd_intf_pins SLOT_0_AXIS] [get_bd_intf_pins DAC_generator_16w_0/m0_axis]
connect_bd_intf_net [get_bd_intf_pins SLOT_0_AXIS] [get_bd_intf_pins system_ila_0/SLOT_0_AXIS]
connect_bd_net [get_bd_pins DAC_generator_16w_0/alg_begin] [get_bd_pins alg_begin_0] [get_bd_pins system_ila_1/probe2]
connect_bd_net [get_bd_pins DAC_generator_16w_0/alg_end] [get_bd_pins alg_end_0] [get_bd_pins system_ila_1/probe3]
connect_bd_net [get_bd_pins DAC_generator_16w_0/phase_out_0] [get_bd_pins system_ila_1/probe0]
connect_bd_net [get_bd_pins DAC_generator_16w_0/phase_out_1] [get_bd_pins system_ila_1/probe1]
connect_bd_net -net PButton_0_1 [get_bd_pins PButton_0] [get_bd_pins DAC_generator_16w_0/new_params]
connect_bd_net -net clk_wiz_0_clk_out1 [get_bd_pins clk] \
  [get_bd_pins system_ila_0/clk] [get_bd_pins system_ila_1/clk] [get_bd_pins DAC_generator_16w_0/axi_aclk]
connect_bd_net -net proc_sys_reset_0_peripheral_aresetn [get_bd_pins resetn] \
  [get_bd_pins system_ila_0/resetn] [get_bd_pins DAC_generator_16w_0/axi_aresetn]

current_bd_instance /
connect_bd_intf_net -intf_net DAC_generator_2chann_0_m1_axis [get_bd_intf_pins hier_DACgeneration/SLOT_1_AXIS] [get_bd_intf_pins usp_rf_data_converter_0/s20_axis]
connect_bd_intf_net [get_bd_intf_ports adc0_clk] [get_bd_intf_pins usp_rf_data_converter_0/adc0_clk]
connect_bd_intf_net [get_bd_intf_ports adc2_clk] [get_bd_intf_pins usp_rf_data_converter_0/adc2_clk]
connect_bd_intf_net -intf_net axi_gpio_0_GPIO [get_bd_intf_ports dip_switches_4bits] [get_bd_intf_pins hier_GPIO/dip_switches_4bits]
connect_bd_intf_net -intf_net axi_gpio_1_GPIO [get_bd_intf_ports led_4bits] [get_bd_intf_pins hier_GPIO/led_4bits]
connect_bd_intf_net -intf_net axi_gpio_3_GPIO [get_bd_intf_ports rgbled0] [get_bd_intf_pins hier_GPIO/rgbled0]
connect_bd_intf_net -intf_net axi_gpio_4_GPIO [get_bd_intf_ports rgbled1] [get_bd_intf_pins hier_GPIO/rgbled1]
connect_bd_intf_net -intf_net axis_constant_0_m_axis [get_bd_intf_pins hier_DACgeneration/SLOT_0_AXIS] [get_bd_intf_pins usp_rf_data_converter_0/s00_axis]
connect_bd_intf_net [get_bd_intf_ports dac2_clk] [get_bd_intf_pins usp_rf_data_converter_0/dac2_clk]
connect_bd_intf_net [get_bd_intf_pins ps8_0_axi_periph/M00_AXI] [get_bd_intf_pins usp_rf_data_converter_0/s_axi]
connect_bd_intf_net [get_bd_intf_pins ps8_0_axi_periph/M01_AXI] [get_bd_intf_pins hier_GPIO/S_AXI2]
connect_bd_intf_net [get_bd_intf_pins ps8_0_axi_periph/M02_AXI] [get_bd_intf_pins hier_GPIO/S_AXI3]
connect_bd_intf_net [get_bd_intf_pins ps8_0_axi_periph/M03_AXI] [get_bd_intf_pins hier_GPIO/S_AXI1]
connect_bd_intf_net [get_bd_intf_pins ps8_0_axi_periph/M04_AXI] [get_bd_intf_pins hier_GPIO/S_AXI4]
connect_bd_intf_net [get_bd_intf_pins ps8_0_axi_periph/M05_AXI] [get_bd_intf_pins hier_GPIO/S_AXI]
connect_bd_intf_net [get_bd_intf_pins ps8_0_axi_periph/M06_AXI] [get_bd_intf_pins hier_GPIO/S_AXI5]
connect_bd_intf_net [get_bd_intf_pins ps8_0_axi_periph/M07_AXI] [get_bd_intf_pins hier_ClockSystem/s_axi_lite]
connect_bd_intf_net [get_bd_intf_pins ps8_0_axi_periph/M08_AXI] [get_bd_intf_pins hier_GPIO/S_AXI7]
connect_bd_intf_net [get_bd_intf_pins ps8_0_axi_periph/M09_AXI] [get_bd_intf_pins hier_GPIO/S_AXI8]
connect_bd_intf_net [get_bd_intf_ports sysref_in] [get_bd_intf_pins usp_rf_data_converter_0/sysref_in]
connect_bd_intf_net [get_bd_intf_pins usp_rf_data_converter_0/m00_axis] [get_bd_intf_pins system_ila_2/SLOT_0_AXIS]
connect_bd_intf_net [get_bd_intf_pins usp_rf_data_converter_0/m02_axis] [get_bd_intf_pins system_ila_2/SLOT_1_AXIS]
connect_bd_intf_net [get_bd_intf_pins usp_rf_data_converter_0/m20_axis] [get_bd_intf_pins system_ila_2/SLOT_2_AXIS]
connect_bd_intf_net [get_bd_intf_pins usp_rf_data_converter_0/m22_axis] [get_bd_intf_pins system_ila_2/SLOT_3_AXIS]
connect_bd_intf_net [get_bd_intf_ports vout00] [get_bd_intf_pins usp_rf_data_converter_0/vout00]
connect_bd_intf_net [get_bd_intf_ports vout10] [get_bd_intf_pins usp_rf_data_converter_0/vout10]
connect_bd_intf_net [get_bd_intf_ports vout20] [get_bd_intf_pins usp_rf_data_converter_0/vout20]
connect_bd_intf_net -intf_net vin0_01_1 [get_bd_intf_ports vin0_01] [get_bd_intf_pins usp_rf_data_converter_0/vin0_01]
connect_bd_intf_net -intf_net vin0_23_1 [get_bd_intf_ports vin0_23] [get_bd_intf_pins usp_rf_data_converter_0/vin0_23]
connect_bd_intf_net -intf_net vin2_01_1 [get_bd_intf_ports vin2_01] [get_bd_intf_pins usp_rf_data_converter_0/vin2_01]
connect_bd_intf_net -intf_net vin2_23_1 [get_bd_intf_ports vin2_23] [get_bd_intf_pins usp_rf_data_converter_0/vin2_23]
connect_bd_intf_net [get_bd_intf_pins zynq_ultra_ps_e_0/M_AXI_HPM0_FPD] [get_bd_intf_pins ps8_0_axi_periph/S00_AXI]
connect_bd_intf_net [get_bd_intf_pins zynq_ultra_ps_e_0/M_AXI_HPM1_FPD] [get_bd_intf_pins ps8_0_axi_periph/S01_AXI]
connect_bd_net -net BUFG_I_0_1 [get_bd_ports PL_CLK] [get_bd_pins hier_ClockSystem/BUFG_I_0]
connect_bd_net -net PButton_0_1 [get_bd_ports PButton_0] [get_bd_pins hier_DACgeneration/PButton_0]
connect_bd_net -net clk_wiz_0_clk_out1 [get_bd_pins hier_ClockSystem/clk_out1] \
  [get_bd_pins usp_rf_data_converter_0/s0_axis_aclk] [get_bd_pins usp_rf_data_converter_0/s1_axis_aclk] \
  [get_bd_pins usp_rf_data_converter_0/s2_axis_aclk] [get_bd_pins hier_DACgeneration/clk]
connect_bd_net -net gpio_io_i_0_1 [get_bd_ports PB_1] [get_bd_pins hier_GPIO/PB_1]
connect_bd_net -net gpio_io_i_1_1 [get_bd_ports PB_2] [get_bd_pins hier_GPIO/PB_2]
connect_bd_net -net gpio_io_i_2_1 [get_bd_ports PB_3] [get_bd_pins hier_GPIO/PB_3]
connect_bd_net -net gpio_io_i_3_1 [get_bd_ports PB_4] [get_bd_pins hier_GPIO/PB_4]
connect_bd_net [get_bd_pins hier_DACgeneration/alg_begin_0] [get_bd_ports PMOD0_0]
connect_bd_net [get_bd_pins hier_DACgeneration/alg_end_0] [get_bd_ports PMOD0_1]
connect_bd_net -net proc_sys_reset_0_peripheral_aresetn [get_bd_pins hier_ClockSystem/peripheral_aresetn] \
  [get_bd_pins usp_rf_data_converter_0/s2_axis_aresetn] [get_bd_pins usp_rf_data_converter_0/s0_axis_aresetn] \
  [get_bd_pins usp_rf_data_converter_0/s1_axis_aresetn] [get_bd_pins hier_DACgeneration/resetn]
connect_bd_net [get_bd_pins rst_ps8_0_99M/peripheral_aresetn] \
  [get_bd_pins ps8_0_axi_periph/S00_ARESETN] [get_bd_pins usp_rf_data_converter_0/s_axi_aresetn] \
  [get_bd_pins ps8_0_axi_periph/M00_ARESETN] [get_bd_pins ps8_0_axi_periph/ARESETN] \
  [get_bd_pins ps8_0_axi_periph/S01_ARESETN] [get_bd_pins ps8_0_axi_periph/M01_ARESETN] \
  [get_bd_pins ps8_0_axi_periph/M02_ARESETN] [get_bd_pins ps8_0_axi_periph/M03_ARESETN] \
  [get_bd_pins ps8_0_axi_periph/M04_ARESETN] [get_bd_pins ps8_0_axi_periph/M05_ARESETN] [get_bd_pins hier_GPIO/s_axi_aresetn] \
  [get_bd_pins ps8_0_axi_periph/M06_ARESETN] [get_bd_pins ps8_0_axi_periph/M07_ARESETN] \
  [get_bd_pins ps8_0_axi_periph/M08_ARESETN] [get_bd_pins ps8_0_axi_periph/M09_ARESETN] \
  [get_bd_pins hier_ClockSystem/s_axi_aresetn] [get_bd_pins ps8_0_axi_periph/M10_ARESETN]
connect_bd_net [get_bd_pins rst_usp_rf_data_converter_0_307M/peripheral_aresetn] \
  [get_bd_pins usp_rf_data_converter_0/m0_axis_aresetn] [get_bd_pins usp_rf_data_converter_0/m2_axis_aresetn] \
  [get_bd_pins system_ila_2/resetn]
connect_bd_net -net src_in_0_1 [get_bd_ports PL_SYSREF] [get_bd_pins hier_ClockSystem/src_in_0]
connect_bd_net [get_bd_pins usp_rf_data_converter_0/clk_adc0] \
  [get_bd_pins usp_rf_data_converter_0/m0_axis_aclk] [get_bd_pins usp_rf_data_converter_0/m2_axis_aclk] \
  [get_bd_pins rst_usp_rf_data_converter_0_307M/slowest_sync_clk] [get_bd_pins system_ila_2/clk]
connect_bd_net -net xpm_cdc_gen_0_dest_out [get_bd_pins hier_ClockSystem/dest_out] [get_bd_pins usp_rf_data_converter_0/user_sysref_dac]
connect_bd_net [get_bd_pins zynq_ultra_ps_e_0/pl_clk0] \
  [get_bd_pins zynq_ultra_ps_e_0/maxihpm0_fpd_aclk] [get_bd_pins ps8_0_axi_periph/S00_ACLK] \
  [get_bd_pins rst_ps8_0_99M/slowest_sync_clk] [get_bd_pins usp_rf_data_converter_0/s_axi_aclk] \
  [get_bd_pins ps8_0_axi_periph/M00_ACLK] [get_bd_pins ps8_0_axi_periph/ACLK] \
  [get_bd_pins zynq_ultra_ps_e_0/maxihpm1_fpd_aclk] [get_bd_pins ps8_0_axi_periph/S01_ACLK] \
  [get_bd_pins ps8_0_axi_periph/M01_ACLK] [get_bd_pins ps8_0_axi_periph/M02_ACLK] [get_bd_pins ps8_0_axi_periph/M03_ACLK] \
  [get_bd_pins ps8_0_axi_periph/M04_ACLK] [get_bd_pins ps8_0_axi_periph/M05_ACLK] [get_bd_pins hier_GPIO/s_axi_aclk] \
  [get_bd_pins ps8_0_axi_periph/M06_ACLK] [get_bd_pins ps8_0_axi_periph/M07_ACLK] [get_bd_pins ps8_0_axi_periph/M08_ACLK] \
  [get_bd_pins ps8_0_axi_periph/M09_ACLK] [get_bd_pins hier_ClockSystem/ref_clk] [get_bd_pins ps8_0_axi_periph/M10_ACLK]
connect_bd_net [get_bd_pins zynq_ultra_ps_e_0/pl_resetn0] \
  [get_bd_pins rst_ps8_0_99M/ext_reset_in] [get_bd_pins rst_usp_rf_data_converter_0_307M/ext_reset_in] \
  [get_bd_pins hier_ClockSystem/ext_reset_in]

# ---- address map ----
assign_bd_address -offset 0x00A0000000 -range 256K -target_address_space [get_bd_addr_spaces zynq_ultra_ps_e_0/Data] [get_bd_addr_segs usp_rf_data_converter_0/s_axi/Reg]
assign_bd_address -offset 0x00A0040000 -range 64K -target_address_space [get_bd_addr_spaces zynq_ultra_ps_e_0/Data] [get_bd_addr_segs hier_GPIO/axi_switches/S_AXI/Reg]
assign_bd_address -offset 0x00A0050000 -range 64K -target_address_space [get_bd_addr_spaces zynq_ultra_ps_e_0/Data] [get_bd_addr_segs hier_GPIO/axi_leds/S_AXI/Reg]
assign_bd_address -offset 0x00A0060000 -range 64K -target_address_space [get_bd_addr_spaces zynq_ultra_ps_e_0/Data] [get_bd_addr_segs hier_GPIO/axi_gpio_0/S_AXI/Reg]
assign_bd_address -offset 0x00A0070000 -range 64K -target_address_space [get_bd_addr_spaces zynq_ultra_ps_e_0/Data] [get_bd_addr_segs hier_GPIO/axi_rgbled0/S_AXI/Reg]
assign_bd_address -offset 0x00A0080000 -range 64K -target_address_space [get_bd_addr_spaces zynq_ultra_ps_e_0/Data] [get_bd_addr_segs hier_GPIO/axi_rgbled1/S_AXI/Reg]
assign_bd_address -offset 0x00A0090000 -range 64K -target_address_space [get_bd_addr_spaces zynq_ultra_ps_e_0/Data] [get_bd_addr_segs hier_GPIO/axi_gpio_1/S_AXI/Reg]
assign_bd_address -offset 0x00A00A0000 -range 64K -target_address_space [get_bd_addr_spaces zynq_ultra_ps_e_0/Data] [get_bd_addr_segs hier_ClockSystem/clk_wiz_0/s_axi_lite/Reg]
assign_bd_address -offset 0x00A00B0000 -range 64K -target_address_space [get_bd_addr_spaces zynq_ultra_ps_e_0/Data] [get_bd_addr_segs hier_GPIO/axi_gpio_3/S_AXI/Reg]
assign_bd_address -offset 0x00A00C0000 -range 64K -target_address_space [get_bd_addr_spaces zynq_ultra_ps_e_0/Data] [get_bd_addr_segs hier_GPIO/axi_gpio_4/S_AXI/Reg]

validate_bd_design
save_bd_design
